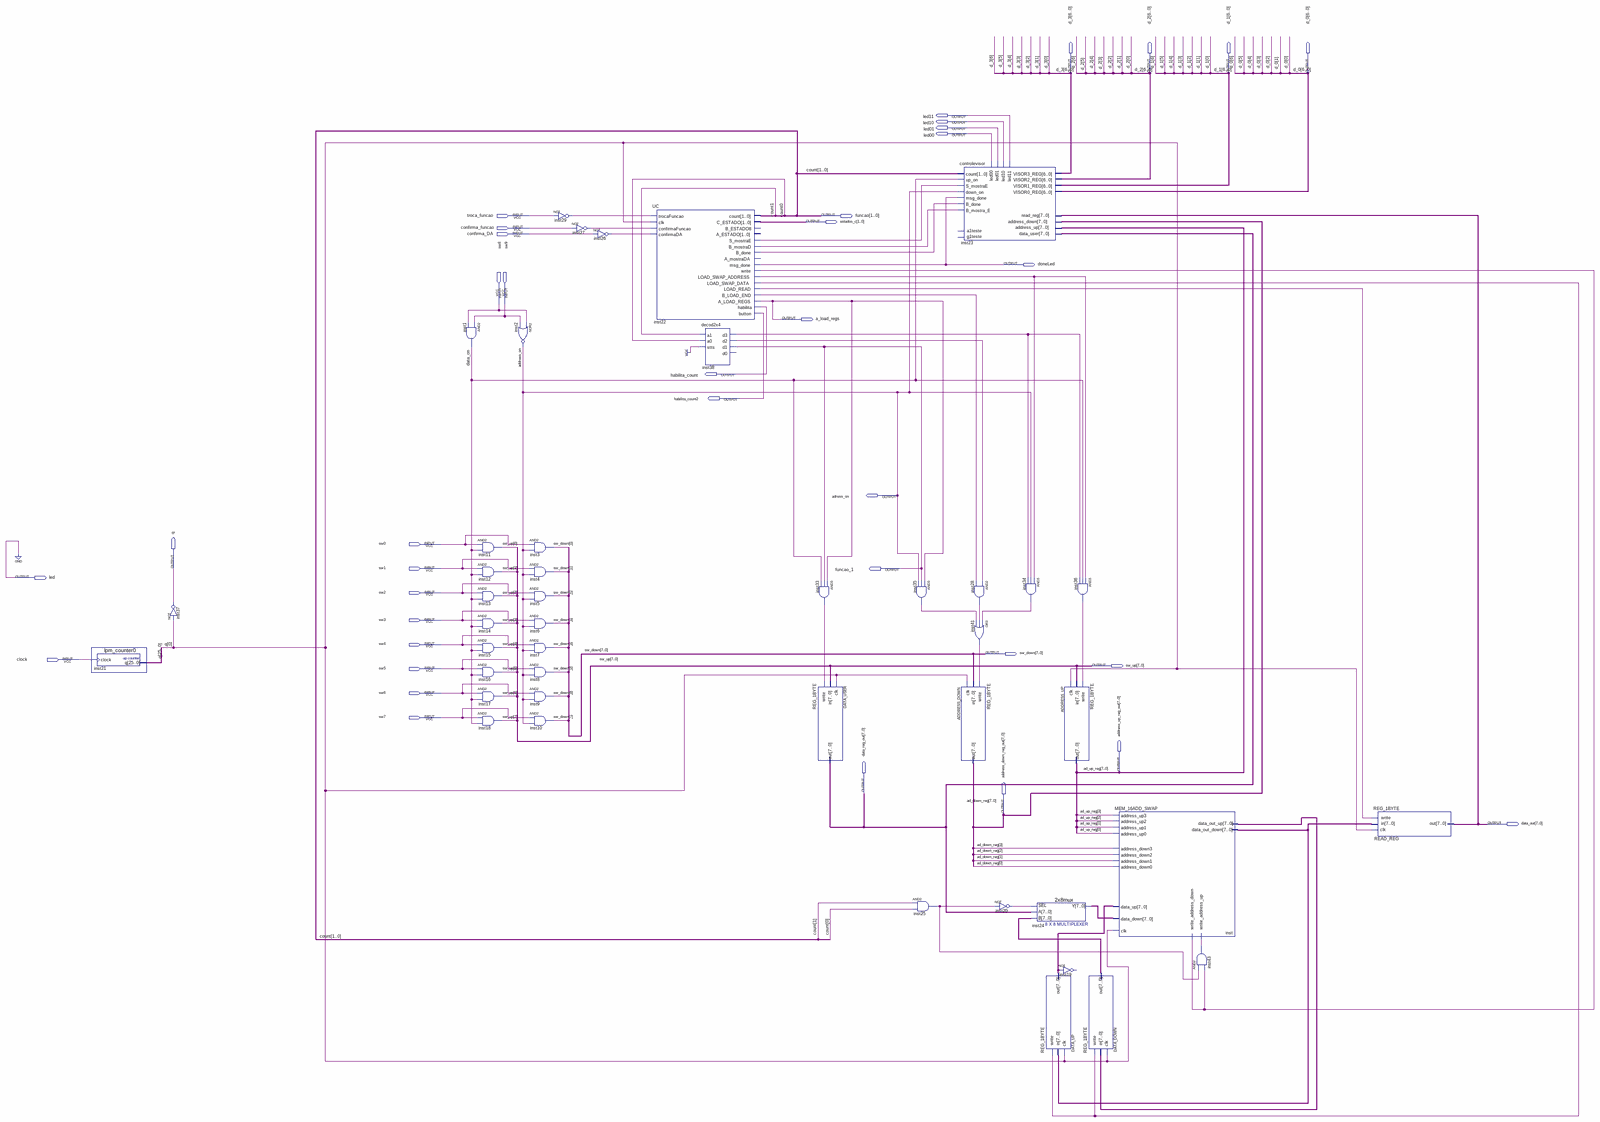
[diagram p0: schematic sheet, whole]
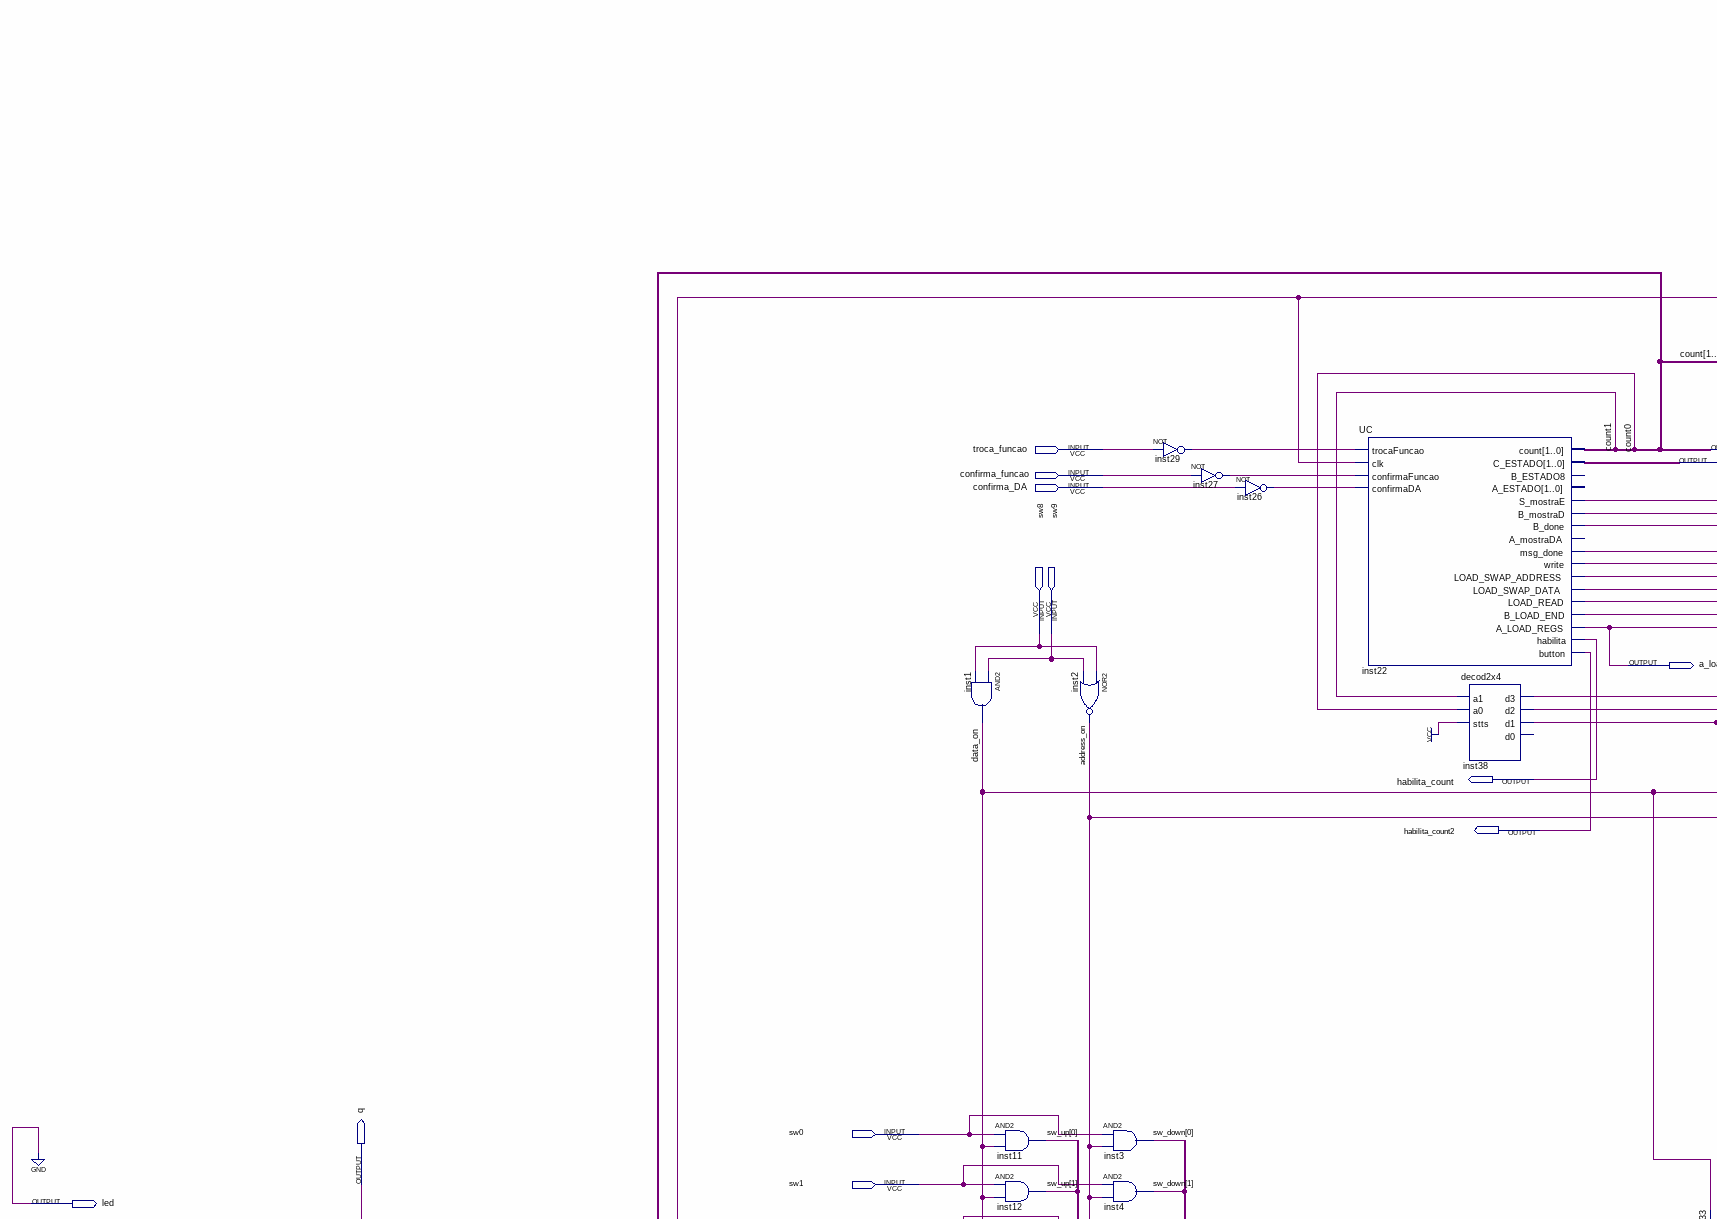
[diagram p1: schematic sheet, upper left part]
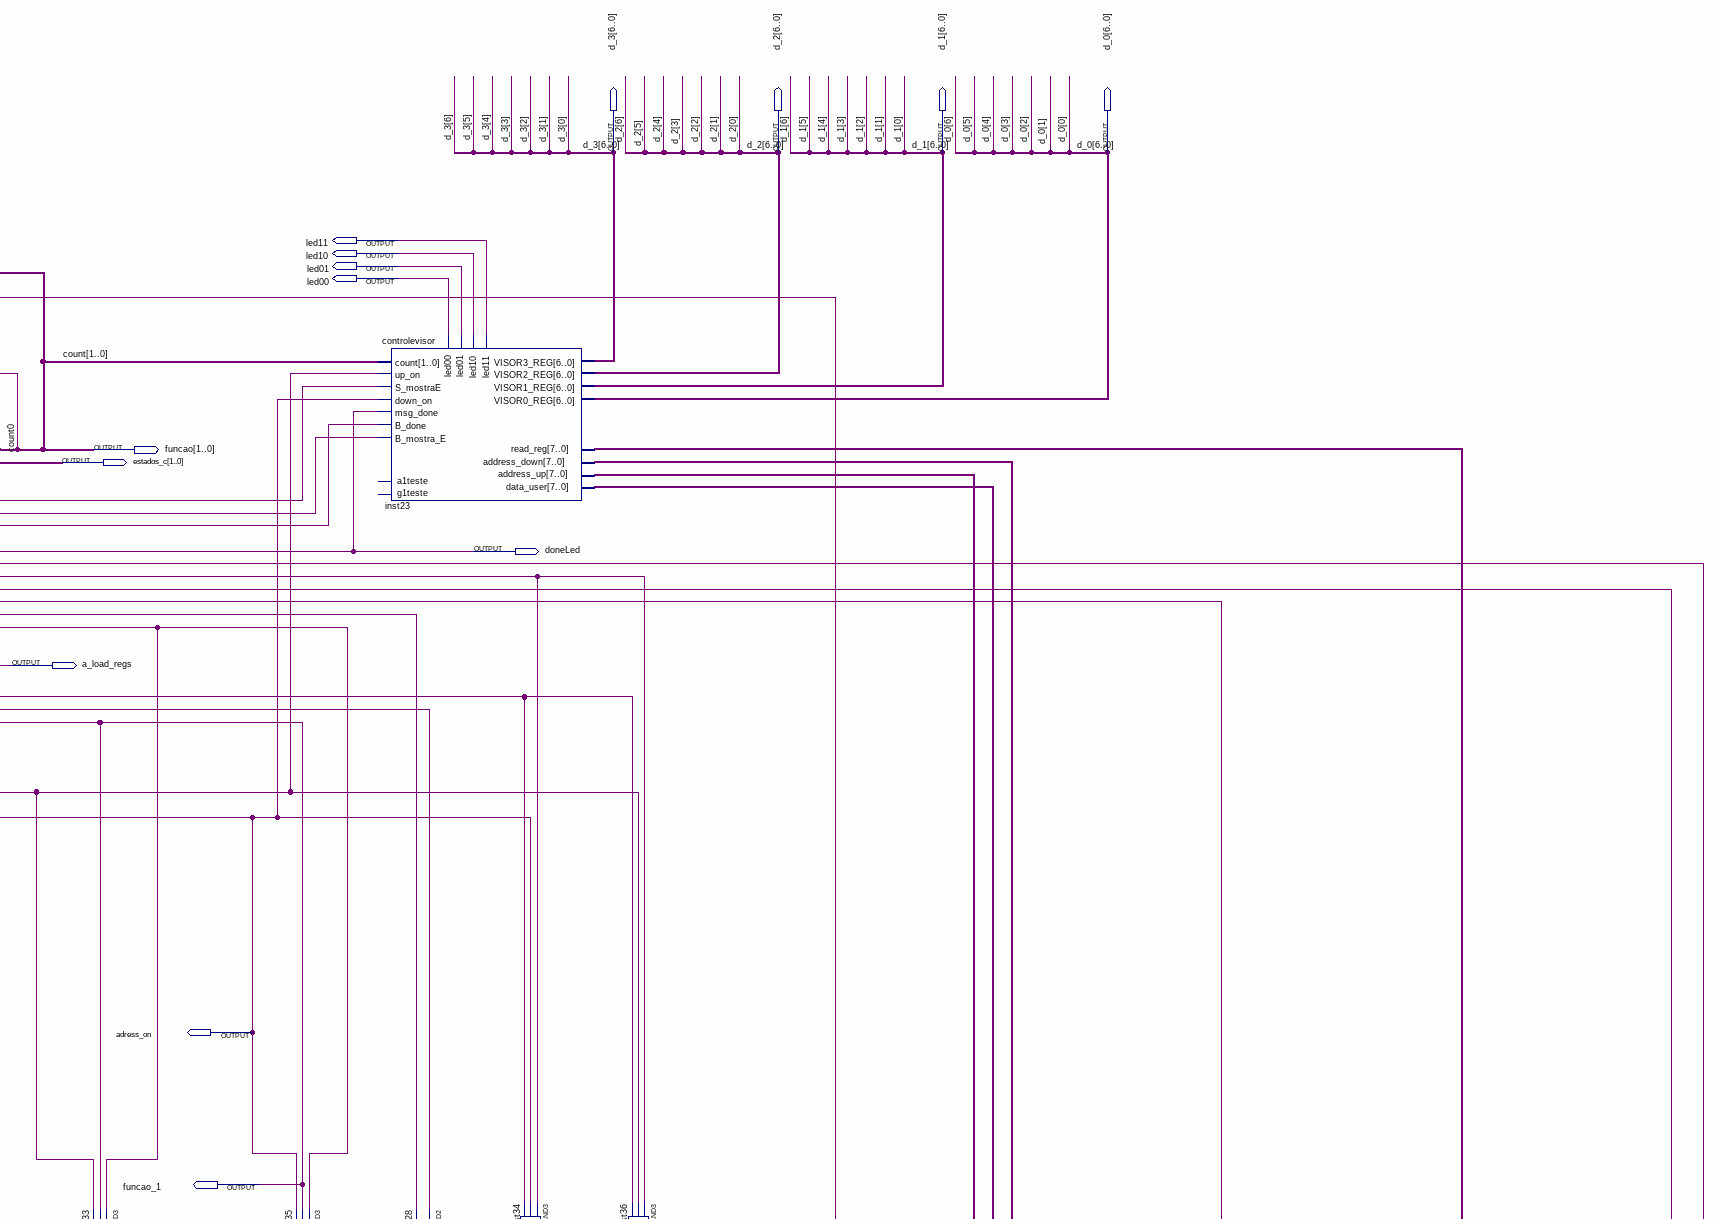
[diagram p2: schematic sheet, upper right part]
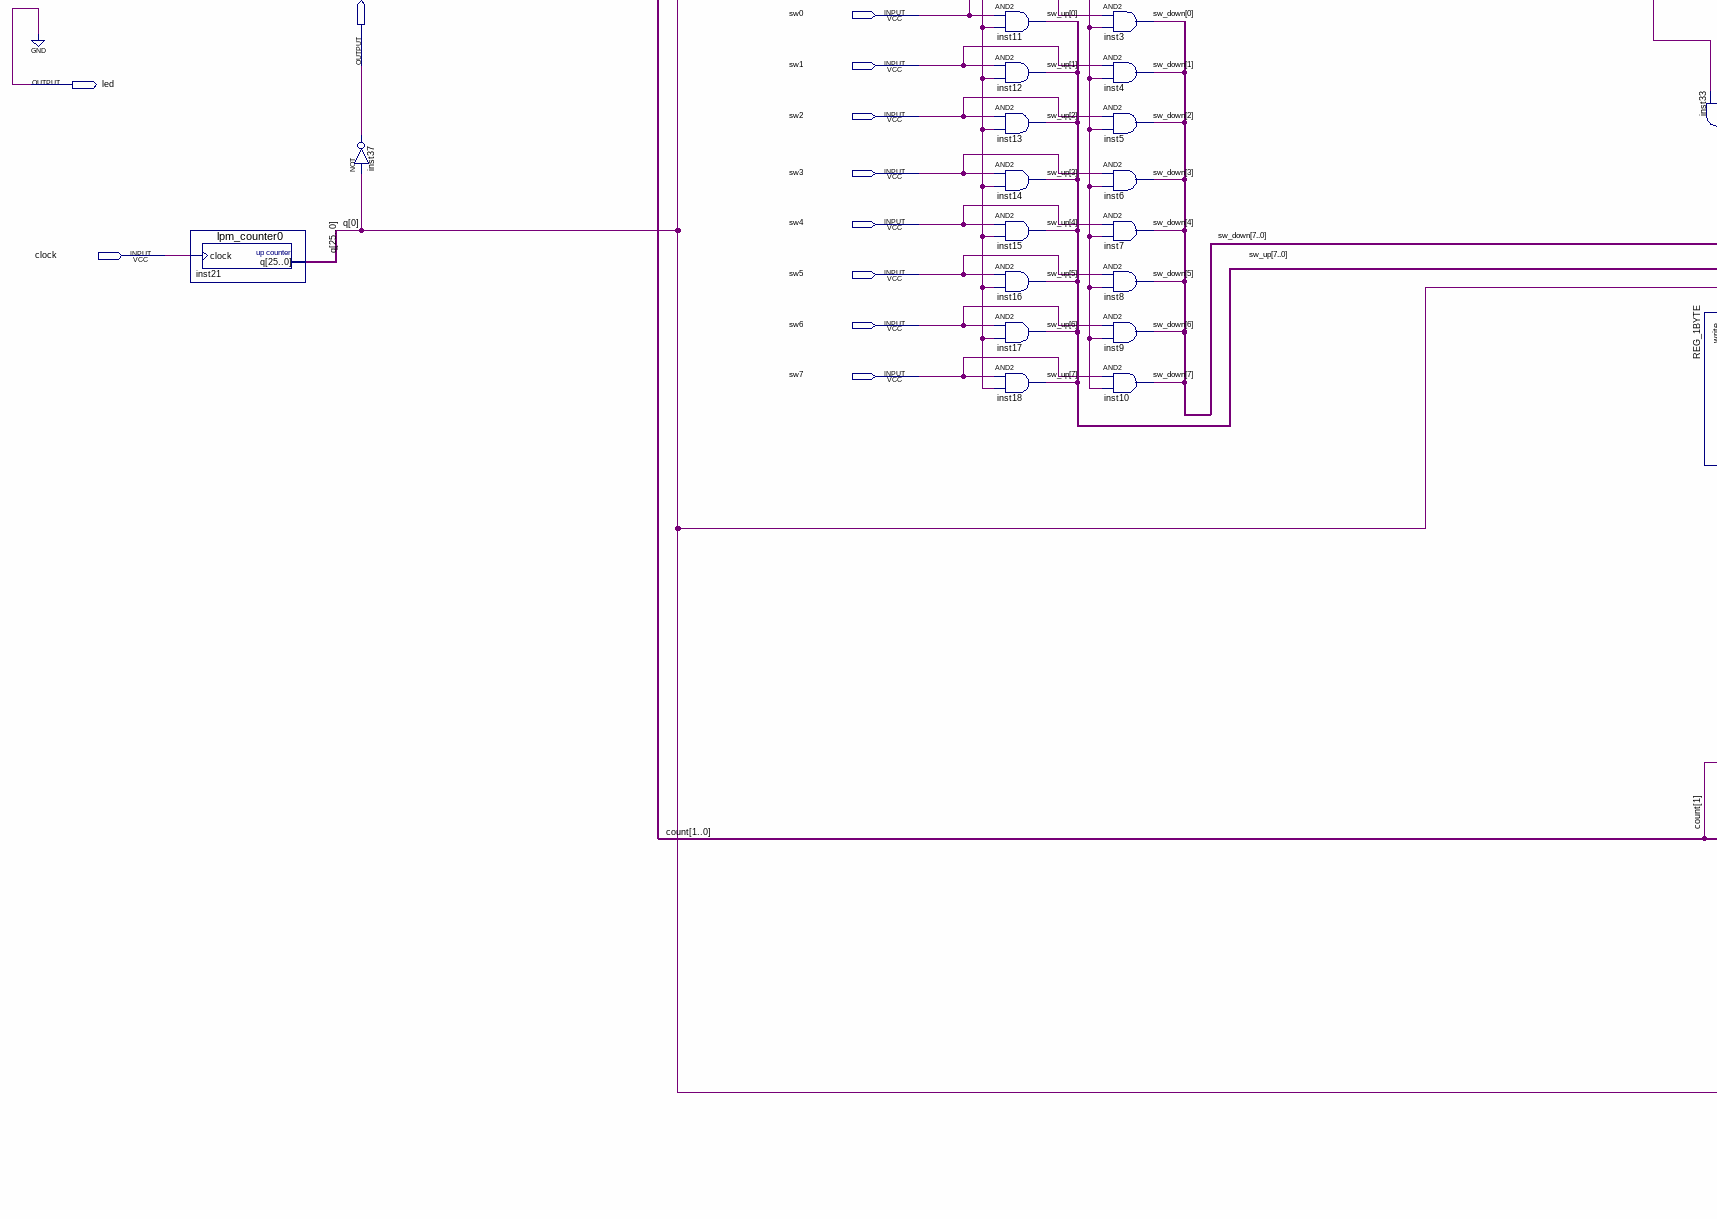
[diagram p3: schematic sheet, lower left part]
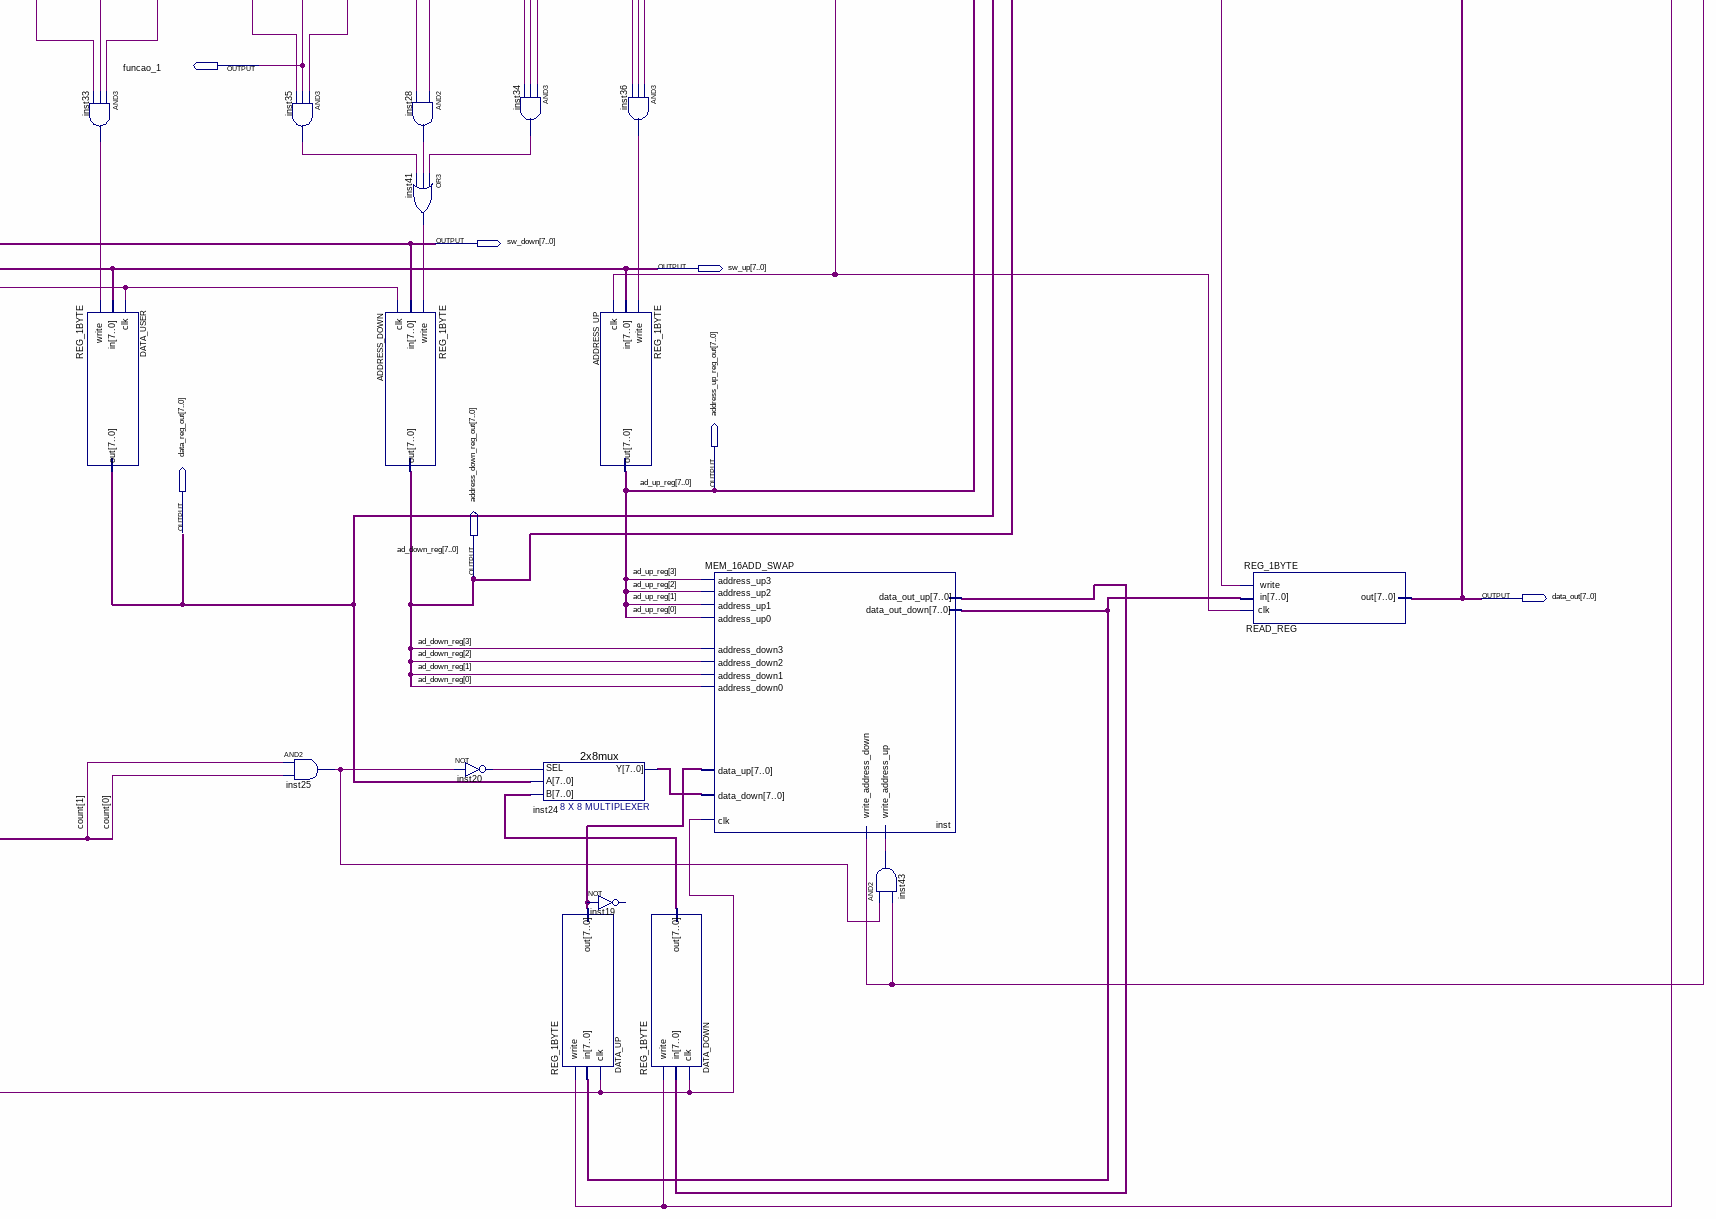
[diagram p4: schematic sheet, lower right part]
// Quartus schematic trabalhofinalfinal_.bdf as structural Verilog: 44 symbols, 38 pins
module trabalhofinalfinal_ (
  input  troca_funcao,
  input  confirma_funcao,
  input  confirma_DA,
  input  sw8,
  input  sw9,
  input  sw0,
  input  sw1,
  input  sw2,
  input  sw3,
  input  sw4,
  input  clock,
  input  sw5,
  input  sw6,
  input  sw7,
  output [6:0] d_3,
  output [6:0] d_2,
  output [6:0] d_1,
  output [6:0] d_0,
  output led11,
  output led10,
  output led01,
  output led00,
  output [1:0] funcao,
  output [1:0] estados_c,
  output doneLed,
  output a_load_regs,
  output habilita_count,
  output habilita_count2,
  output adress_on,
  output q,
  output funcao_1,
  output led,
  output [7:0] sw_down,
  output [7:0] sw_up,
  output [7:0] address_up_reg_out,
  output [7:0] data_reg_out,
  output [7:0] address_down_reg_out,
  output [7:0] data_out
);

  wire data_on, inst20_out, inst22_b_done, inst22_b_load_end, inst22_b_mostrad, inst22_load_read,
       inst22_load_swap_address, inst22_load_swap_data, inst22_s_mostrae, inst22_write, inst25_out,
       inst26_out, inst27_out, inst28_out, inst29_out, inst33_out, inst34_out, inst35_out, inst36_out,
       inst38_d2, inst38_d3, inst41_out, inst43_out;
  wire [7:0] DATA_DOWN_out, DATA_UP_out, inst24_y, inst_data_out_down, inst_data_out_up;
  wire [25:0] q_bus;

  lpm_counter0 inst21 (.clock(clock), .q(q_bus));
  not inst37 (q, q_bus[0]);
  and inst1 (data_on, sw9, sw8);
  and inst11 (sw_up[0], sw0, data_on);
  and inst12 (sw_up[1], sw1, data_on);
  and inst13 (sw_up[2], sw2, data_on);
  and inst14 (sw_up[3], sw3, data_on);
  and inst15 (sw_up[4], sw4, data_on);
  and inst16 (sw_up[5], sw5, data_on);
  and inst17 (sw_up[6], sw6, data_on);
  and inst18 (sw_up[7], sw7, data_on);
  nor inst2 (adress_on, sw8, sw9);
  and inst3 (sw_down[0], sw0, adress_on);
  and inst4 (sw_down[1], sw1, adress_on);
  and inst5 (sw_down[2], sw2, adress_on);
  and inst6 (sw_down[3], sw3, adress_on);
  and inst7 (sw_down[4], sw4, adress_on);
  and inst8 (sw_down[5], sw5, adress_on);
  and inst9 (sw_down[6], sw6, adress_on);
  and inst10 (sw_down[7], sw7, adress_on);
  not inst29 (inst29_out, troca_funcao);
  not inst27 (inst27_out, confirma_funcao);
  not inst26 (inst26_out, confirma_DA);
  UC inst22 (
    .trocaFuncao(inst29_out), .clk(q_bus[0]), .confirmaFuncao(inst27_out), .confirmaDA(inst26_out),
    .count(funcao), .C_ESTADO(estados_c), .S_mostraE(inst22_s_mostrae), .B_mostraD(inst22_b_mostrad),
    .B_done(inst22_b_done), .msg_done(doneLed), .write(inst22_write),
    .LOAD_SWAP_ADDRESS(inst22_load_swap_address), .LOAD_SWAP_DATA(inst22_load_swap_data),
    .LOAD_READ(inst22_load_read), .B_LOAD_END(inst22_b_load_end), .A_LOAD_REGS(a_load_regs),
    .habilita(habilita_count), .button(habilita_count2));  // open: B_ESTADO8, A_ESTADO, A_mostraDA
  decod2x4 inst38 (
    .a1(funcao[1]), .a0(funcao[0]), .stts(1'b1), .d3(inst38_d3), .d2(inst38_d2), .d1(funcao_1));  // open: d0
  and inst33 (inst33_out, a_load_regs, funcao_1, data_on);
  REG_1BYTE DATA_USER (.write(inst33_out), .clk(q_bus[0]), .in(sw_up), .out(data_reg_out));
  and inst35 (inst35_out, a_load_regs, funcao_1, adress_on);
  and inst25 (inst25_out, funcao[1], funcao[0]);
  controlevisor inst23 (
    .count(funcao), .up_on(data_on), .S_mostraE(inst22_s_mostrae), .down_on(adress_on), .msg_done(doneLed),
    .B_done(inst22_b_done), .B_mostra_E(inst22_b_mostrad), .read_reg(data_out),
    .address_down(address_down_reg_out), .address_up(address_up_reg_out), .data_user(data_reg_out),
    .led00(led00), .led01(led01), .led10(led10), .led11(led11), .VISOR3_REG(d_3), .VISOR2_REG(d_2),
    .VISOR1_REG(d_1), .VISOR0_REG(d_0));  // open: a1teste, g1teste
  and inst28 (inst28_out, inst38_d2, inst22_b_load_end);
  or inst41 (inst41_out, inst34_out, inst28_out, inst35_out);
  REG_1BYTE ADDRESS_DOWN (.write(inst41_out), .clk(q_bus[0]), .in(sw_down), .out(address_down_reg_out));
  not inst20 (inst20_out, inst25_out);
  and inst34 (inst34_out, inst22_load_swap_address, adress_on, inst38_d3);
  \2x8mux  inst24 (.SEL(inst20_out), .A(data_reg_out), .B(DATA_DOWN_out), .Y(inst24_y));
  REG_1BYTE DATA_UP (.write(inst22_load_swap_data), .clk(q_bus[0]), .in(inst_data_out_down), .out(DATA_UP_out));
  REG_1BYTE ADDRESS_UP (.write(inst36_out), .clk(q_bus[0]), .in(sw_up), .out(address_up_reg_out));
  // NOT inst19 has open pins: IN=DATA_UP_out, OUT=open
  and inst36 (inst36_out, inst22_load_swap_address, data_on, inst38_d3);
  REG_1BYTE DATA_DOWN (.write(inst22_load_swap_data), .clk(q_bus[0]), .in(inst_data_out_up), .out(DATA_DOWN_out));
  MEM_16ADD_SWAP inst (
    .address_down0(address_down_reg_out[0]), .address_down1(address_down_reg_out[1]),
    .address_down2(address_down_reg_out[2]), .address_down3(address_down_reg_out[3]),
    .address_up0(address_up_reg_out[0]), .address_up1(address_up_reg_out[1]),
    .address_up2(address_up_reg_out[2]), .address_up3(address_up_reg_out[3]), .data_down(inst24_y),
    .clk(q_bus[0]), .data_up(DATA_UP_out), .write_address_down(inst22_write), .write_address_up(inst43_out),
    .data_out_down(inst_data_out_down), .data_out_up(inst_data_out_up));
  and inst43 (inst43_out, inst25_out, inst22_write);
  REG_1BYTE READ_REG (.write(inst22_load_read), .clk(q_bus[0]), .in(inst_data_out_down), .out(data_out));

  assign led = 1'b0;

  // Other names for the same wires on the sheet: ad_down_reg[7:0] = address_down_reg_out;
  //   ad_up_reg[7:0] = address_up_reg_out; address_on = adress_on; count[1:0] = funcao; count0 = funcao[0];
  //   count1 = funcao[1]
endmodule
